# EAGLE schematic powerSupply (EAGLE 9.6.2)
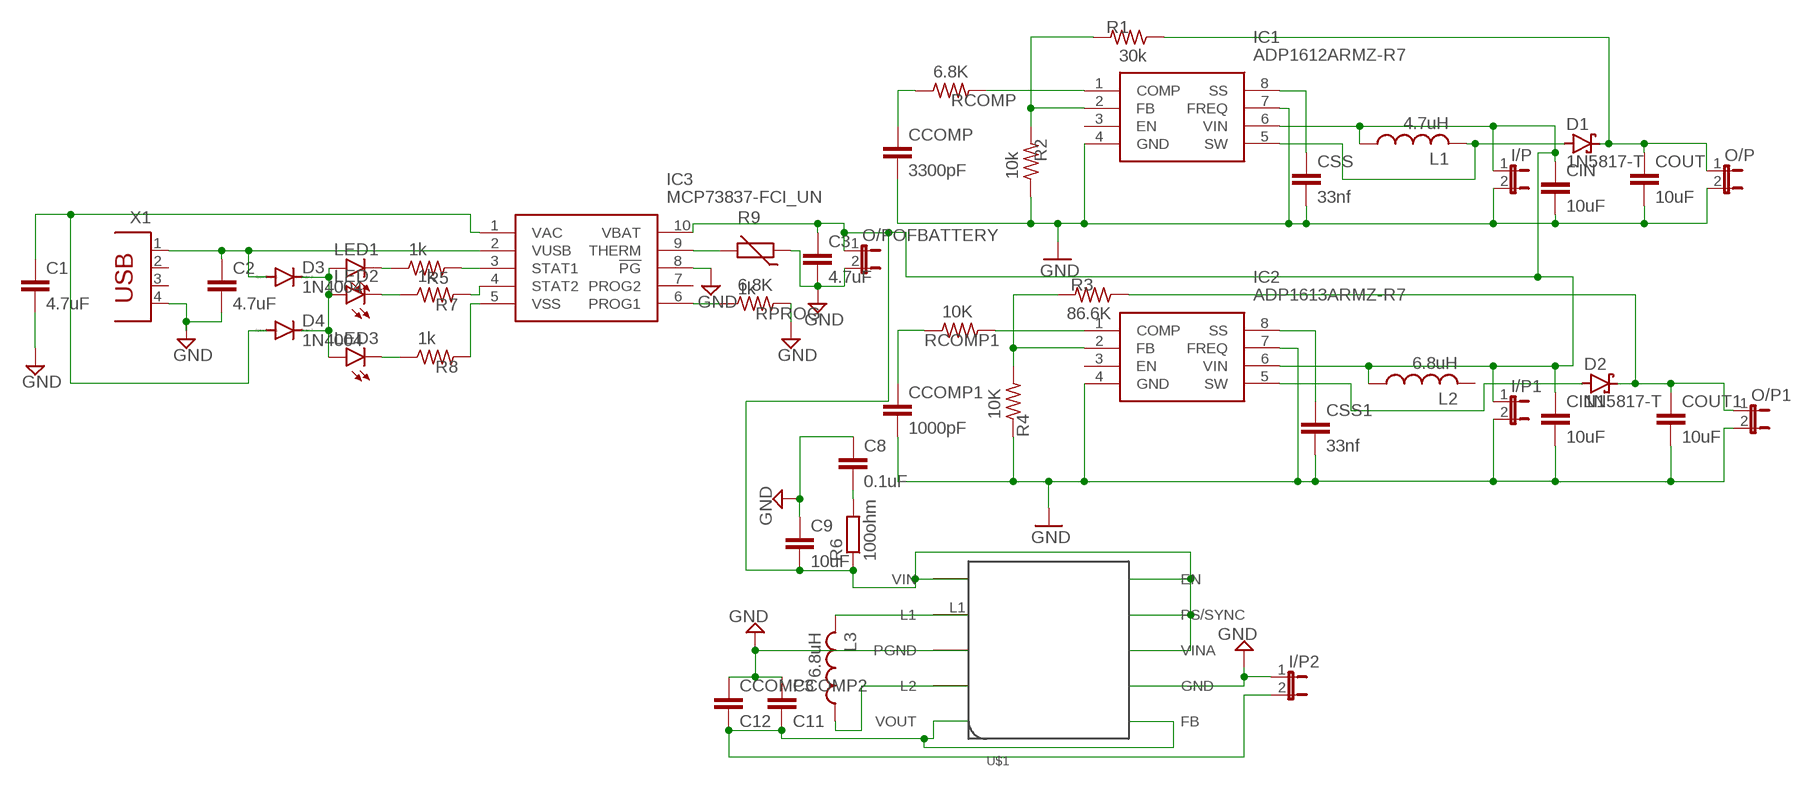
[diagram p0: schematic, sheet 1]

## Parts
C1  4.7uF  C-EU025-024X044  [C025-024X044]
C2  4.7uF  C-EU025-024X044  [C025-024X044]
C3  4.7uF  C-EU025-024X044  [C025-024X044]
C8  0.1uF  C-EU025-024X044  [C025-024X044]
C9  10uF  C-EU025-024X044  [C025-024X044]
CCOMP  3300pF  C-EU025-024X044  [C025-024X044]
CCOMP1  1000pF  C-EU025-024X044  [C025-024X044]
CCOMP2  C11  C-EU025-024X044  [C025-024X044]
CCOMP3  C12  C-EU025-024X044  [C025-024X044]
CIN  10uF  C-EU025-024X044  [C025-024X044]
CIN1  10uF  C-EU025-024X044  [C025-024X044]
COUT  10uF  C-EU025-024X044  [C025-024X044]
COUT1  10uF  C-EU025-024X044  [C025-024X044]
CSS  33nf  C-EU025-024X044  [C025-024X044]
CSS1  33nf  C-EU025-024X044  [C025-024X044]
D1  1N5817-T  BAT60J  [SOD323_ST]
D2  1N5817-T  BAT60J  [SOD323_ST]
D3  1N4004  [DO41-10]
D4  1N4004  [DO41-10]
I/P  JP1E  [JP1]
I/P1  JP1E  [JP1]
I/P2  JP1E  [JP1]
IC1  ADP1612ARMZ-R7  [SOP65P490X110-8N]
IC2  ADP1613ARMZ-R7  [SOP65P490X110-8N]
IC3  MCP73837-FCI_UN  [SOP50P490X110-10N]
L1  4.7uH  L-US0204/7  [0204/7]
L2  6.8uH  L-US0204/7  [0204/7]
L3  6.8uH  L-US0204/7  [0204/7]
LED1  LED5MM  [LED5MM]
LED2  LED5MM  [LED5MM]
LED3  LED5MM  [LED5MM]
O/P  JP1E  [JP1]
O/P1  JP1E  [JP1]
O/POFBATTERY  JP1E  [JP1]
R1  30k  R-US_0204/2V  [0204V]
R2  10k  R-US_0204/2V  [0204V]
R3  86.6K  R-US_0204/2V  [0204V]
R4  10K  R-US_0204/2V  [0204V]
R5  1k  R-US_0204/2V  [0204V]
R6  100ohm  R-EU_0207/10  [0207/10]
R7  1k  R-US_0204/2V  [0204V]
R8  1k  R-US_0204/2V  [0204V]
R9  1k  THERMISTOR-2,5  [RS-2,5]
RCOMP  6.8K  R-US_0204/2V  [0204V]
RCOMP1  10K  R-US_0204/2V  [0204V]
RPROG  6.8K  R-US_0204/2V  [0204V]
U$1  TPS63002  [TPS63002]
X1  PN87520  [PN87520]

## Nets
GND: C1.2 C2.2 C3.2 C8.1 C9.1 CCOMP1.2 CCOMP2.1 CCOMP3.1 CCOMP.2 CIN1.2 CIN.2 COUT1.2 COUT.2 CSS1.2 CSS.2 I/P1.2 I/P2.1 I/P.2 IC1.4(GND) IC1.7(FREQ) IC2.4(GND) IC2.7(FREQ) IC3.8(!PG) O/P1.2 O/P.2 O/POFBATTERY.2 R2.1 R4.1 R9.1 RPROG.2 U$1.GND U$1.PGND X1.4
N$1: IC1.1(COMP) RCOMP.2
N$2: CCOMP.1 RCOMP.1
N$3: IC1.2(FB) R1.2 R2.2
N$4: L3.2 U$1.L1
N$5: D1.A IC1.5(SW) L1.2
N$6: COUT.1 D1.C O/P.1 R1.1
N$7: IC2.1(COMP) RCOMP1.2
N$8: CCOMP1.1 RCOMP1.1
N$9: CSS.1 IC1.8(SS)
N$11: CSS1.1 IC2.8(SS)
N$12: COUT1.1 D2.C O/P1.1 R3.1
N$13: D2.A IC2.5(SW)
N$14: L3.1 U$1.L2
N$15: IC2.2(FB) R3.2 R4.2
N$16: CCOMP2.2 CCOMP3.2 I/P2.2 U$1.FB U$1.VOUT
N$17: C2.1 D3.A IC3.2(VUSB) X1.1
N$18: C1.1 D4.A IC3.1(VAC)
N$19: C8.2 R6.2
N$20: LED3.K(C) R8.1
N$21: IC3.5(VSS) R8.2
N$22: C3.1 C9.2 CIN1.1 CIN.1 I/P1.1 I/P.1 IC1.6(VIN) IC2.6(VIN) IC3.10(VBAT) L1.1 L2.1 O/POFBATTERY.1 R6.1 U$1.EN U$1.PS/SYNC U$1.VIN U$1.VINA
N$23: IC3.6(PROG1) RPROG.1
N$24: IC3.9(THERM) R9.2
N$26: D3.C D4.C LED1.A LED2.A LED3.A
N$28: LED1.K(C) R5.1
N$29: LED2.K(C) R7.1
N$30: IC3.3(STAT1) R5.2
N$31: IC3.4(STAT2) R7.2
Unconnected: IC1.3(EN) IC2.3(EN) IC3.7(PROG2) L2.2 X1.2 X1.3

## Library data of the parts
C1-C3 C8 C9 CCOMP CCOMP1-CCOMP3 CIN CIN1 COUT COUT1 CSS CSS1 = rcl:C-EU: CAPACITOR, European symbol; SPICEPREFIX: C
D1 D2 = diode:BAT60J: Schottky barrier diode Source: www.st.com, BAT60J.pdf
D3 D4 = diode:1N4004: DIODE general purpose rectifier, 1 A
I/P I/P1 I/P2 O/P O/P1 O/POFBATTERY = jumper:JP1E: JUMPER
IC1 = ADP1612ARMZ-R7:ADP1612ARMZ-R7: Analog Devices ADP1612ARMZ-R7, Step Up DC-DC Converter, 1.9A, Adjustable, 5.5 20 V, 8-Pin MSOP Source: Datasheet <http://uk.rs-online.com/web/p/products/7427727P>; ARROW_PART_NUMBER: ADP1612ARMZ-R7; ARROW_PRICE-STOCK: https://www.arrow.com/en/products/adp1612armz-r7/analog-devices; DESCRIPTION: Analog Devices ADP1612ARMZ-R7, Step Up DC-DC Converter, 1.9A, Adjustable, 5.5 20 V, 8-Pin MSOP; HEIGHT: 1.1mm; MANUFACTURER_NAME: Analog Devices; MANUFACTURER_PART_NUMBER: ADP1612ARMZ-R7; MOUSER_PART_NUMBER: 584-ADP1612ARMZ-R7; MOUSER_PRICE-STOCK: https://www.mouser.com/Search/Refine.aspx?Keyword=584-ADP1612ARMZ-R7
IC2 = ADP1613ARMZ-R7:ADP1613ARMZ-R7: Analog Devices ADP1613ARMZ-R7, Step Up DC-DC Converter, 2.5A, Adjustable, 5.5 20 V, 8-Pin MSOP Source: Datasheet <https://datasheet.lcsc.com/szlcsc/Analog-Devices-ADI-ADP1613ARMZ-R7_C132279.pdf>; ARROW_PART_NUMBER: ADP1613ARMZ-R7; ARROW_PRICE-STOCK: https://www.arrow.com/en/products/adp1613armz-r7/analog-devices; DESCRIPTION: Analog Devices ADP1613ARMZ-R7, Step Up DC-DC Converter, 2.5A, Adjustable, 5.5 20 V, 8-Pin MSOP; HEIGHT: 1.1mm; MANUFACTURER_NAME: Analog Devices; MANUFACTURER_PART_NUMBER: ADP1613ARMZ-R7; MOUSER_PART_NUMBER: 584-ADP1613ARMZ-R7; MOUSER_PRICE-STOCK: https://www.mouser.co.uk/ProductDetail/Analog-Devices/ADP1613ARMZ-R7?qs=WIvQP4zGanhDtCwLTFW%252BRw%3D%3D
IC3 = MCP73837-FCI_UN:MCP73837-FCI_UN: Li-Ion Charger USB/DC 4.2V 1A PG MSOP10 Source: Datasheet <http://ww1.microchip.com/downloads/en/DeviceDoc/22071B.pdf>; ARROW_PART_NUMBER: MCP73837-FCI/UN; ARROW_PRICE-STOCK: https://www.arrow.com/en/products/mcp73837-fciun/microchip-technology; DESCRIPTION: Li-Ion Charger USB/DC 4.2V 1A PG MSOP10; HEIGHT: 1.1mm; MANUFACTURER_NAME: Microchip; MANUFACTURER_PART_NUMBER: MCP73837-FCI/UN; MOUSER_PART_NUMBER: 579-MCP73837-FCI/UN; MOUSER_PRICE-STOCK: https://www.mouser.co.uk/ProductDetail/Microchip-Technology/MCP73837-FCI-UN?qs=hH%252BOa0VZEiDKGj395FRsiw%3D%3D
L1-L3 = rcl:L-US: INDUCTOR, American symbol; SPICEPREFIX: L
LED1-LED3 = led:LED: LED OSRAM: - CHIPLED LG R971, LG N971, LY N971, LG Q971, LY Q971, LO R971, LY R971 LH N974, LH R974 LS Q976, LO Q976, LY Q976 LO Q996 - Hyper CHIPLED LW Q18S LB Q993, LB Q99A, LB R99A - SideLED LS A670, LO A670, LY A670, LG A670, LP A670 LB A673, LV A673, LT A673, LW A673 LH A674 LY A675 LS A676, LA A676, LO A676, LY A676, LW A676 LS A679, LY A679, LG A679 - Hyper Micro SIDELED® LS Y876, LA Y876, LO Y876, LY Y876 LT Y87S - SmartLED LW L88C, LW L88S LB L89C, LB L89S, LG L890 LS L89K, LO L89K, LY L89K LS L896, LA L896, LO L896, LY L896 - TOPLED LS T670, LO T670, LY T670, LG T670, LP T670 LSG T670, LSP T670, LSY T670, LOP T670, LYG T670 LG T671, LOG T671, LSG T671 LB T673, LV T673, LT T673, LW T673 LH T674 LS T676, LA T676, LO T676, LY T676, LB T676, LH T676, LSB T676, LW T676 LB T67C, LV T67C, LT T67C, LS T67K, LO T67K, LY T67K, LW E67C LS E67B, LA E67B, LO E67B, LY E67B, LB E67C, LV E67C, LT E67C LW T67C LS T679, LY T679, LG T679 LS T770, LO T770, LY T770, LG T770, LP T770 LB T773, LV T773, LT T773, LW T773 LH T774 LS E675, LA E675, LY E675, LS T675 LS T776, LA T776, LO T776, LY T776, LB T776 LHGB T686 LT T68C, LB T68C - Hyper Mini TOPLED® LB M676 - Mini TOPLED Santana® LG M470 LS M47K, LO M47K, LY M47K Source: http://www.osram.convergy.de LUXEON: - LUMILED® LXK2-PW12-R00, LXK2-PW12-S00, LXK2-PW14-U00, LXK2-PW14-V00 LXK2-PM12-R00, LXK2-PM12-S00, LXK2-PM14-U00 LXK2-PE12-Q00, LXK2-PE12-R00, LXK2-PE12-S00, LXK2-PE14-T00, LXK2-PE14-U00 LXK2-PB12-K00, LXK2-PB12-L00, LXK2-PB12-M00, LXK2-PB14-N00, LXK2-PB14-P00, LXK2-PB14-Q00 LXK2-PR12-L00, LXK2-PR12-M00, LXK2-PR14-Q00, LXK2-PR14-R00 LXK2-PD12-Q00, LXK2-PD12-R00, LXK2-PD12-S00 LXK2-PH12-R00, LXK2-PH12-S00 LXK2-PL12-P00, LXK2-PL12-Q00, LXK2-PL12-R00 Source: www.luxeon.com KINGBRIGHT: KA-3528ASYC Source: www.kingbright.com
R1-R5 R7 R8 RCOMP RCOMP1 RPROG = rcl:R-US_: RESISTOR, American symbol; SPICEPREFIX: R
R6 = rcl:R-EU_: RESISTOR, European symbol; SPICEPREFIX: R
R9 = varistor:THERMISTOR: THERMISTOR
U$1 = TPS63002:TPS63002
X1 = con-berg:PN87520: BERG USB connector; OC_FARNELL: unknown; OC_NEWARK: unknown